# Altium schematic sheet Power.SchDoc
size A
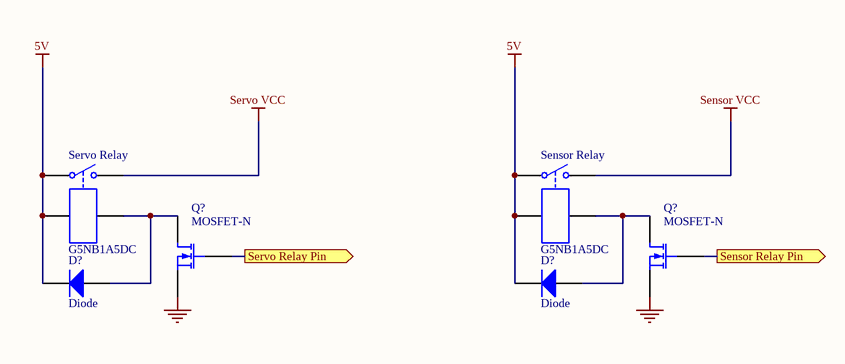
[diagram p0: Power.SchDoc]

## Parts
(Parts that share a designator on the sheet are numbered #1, #2 ... from top to bottom, then left to right.)
D?#1  Diode  [SMC]
D?#2  Diode  [SMC]
Q?#1  MOSFET-N  [E3]
Q?#2  MOSFET-N  [E3]
Sensor_Relay  G5NB1A5DC  [MODULE4]
Servo_Relay  G5NB1A5DC  [MODULE4]

## Ports
Sensor Relay Pin (out), Servo Relay Pin (out)

## Nets
5V: D?#1.2(K) D?#2.2(K) Sensor_Relay.1 Sensor_Relay.3 Servo_Relay.1 Servo_Relay.3
GND: Q?#1.3(S) Q?#2.3(S)
Sensor VCC: Sensor_Relay.2
Servo VCC: Servo_Relay.2
Sensor Relay Pin: Q?#2.2(G) ; port Sensor Relay Pin
Servo Relay Pin: Q?#1.2(G) ; port Servo Relay Pin
NetD?#1_1: D?#1.1(A) Q?#1.1(D) Servo_Relay.4
NetD?#2_1: D?#2.1(A) Q?#2.1(D) Sensor_Relay.4

## Library data of the parts
D?#1 D?#2 = Diode: Default Diode; Published: 8-Jun-2000; LatestRevisionDate: 17-Jul-2002; LatestRevisionNote: Re-released for DXP Platform.; PackageVersion: Sep-1996; PackageReference: SMC; Publisher: Altium Limited; PackageDescription: DO-214-AB/SMC; 2 C-Bend Leads; Body 7.9 x 5.9 mm, inc. leads (LxW); Code_JEDEC: DO-214-AB
Q?#1 Q?#2 = MOSFET-N: N-Channel MOSFET; Published: 8-Jun-2000; LatestRevisionDate: 17-Jul-2002; LatestRevisionNote: Re-released for DXP Platform.; PackageVersion: 1995/1996; PackageReference: E3; Publisher: Altium Limited; PackageDescription: TO, Flat Index; 3 In-Line, Axial Leads; Body Dia. 4.6mm; Lead Dia. 0.5 mm (max)
Sensor_Relay Servo_Relay = Relay-SPST: Single-Pole Single-Throw Relay; Ref fournisseur: 2213805; Fournisseur: Farnell; Fabricant: OMRON; Ref Fabricant: G5NB1A5DC